# Altium schematic sheet COMM_2022-13-02.schdoc
size 425 x 175 mm
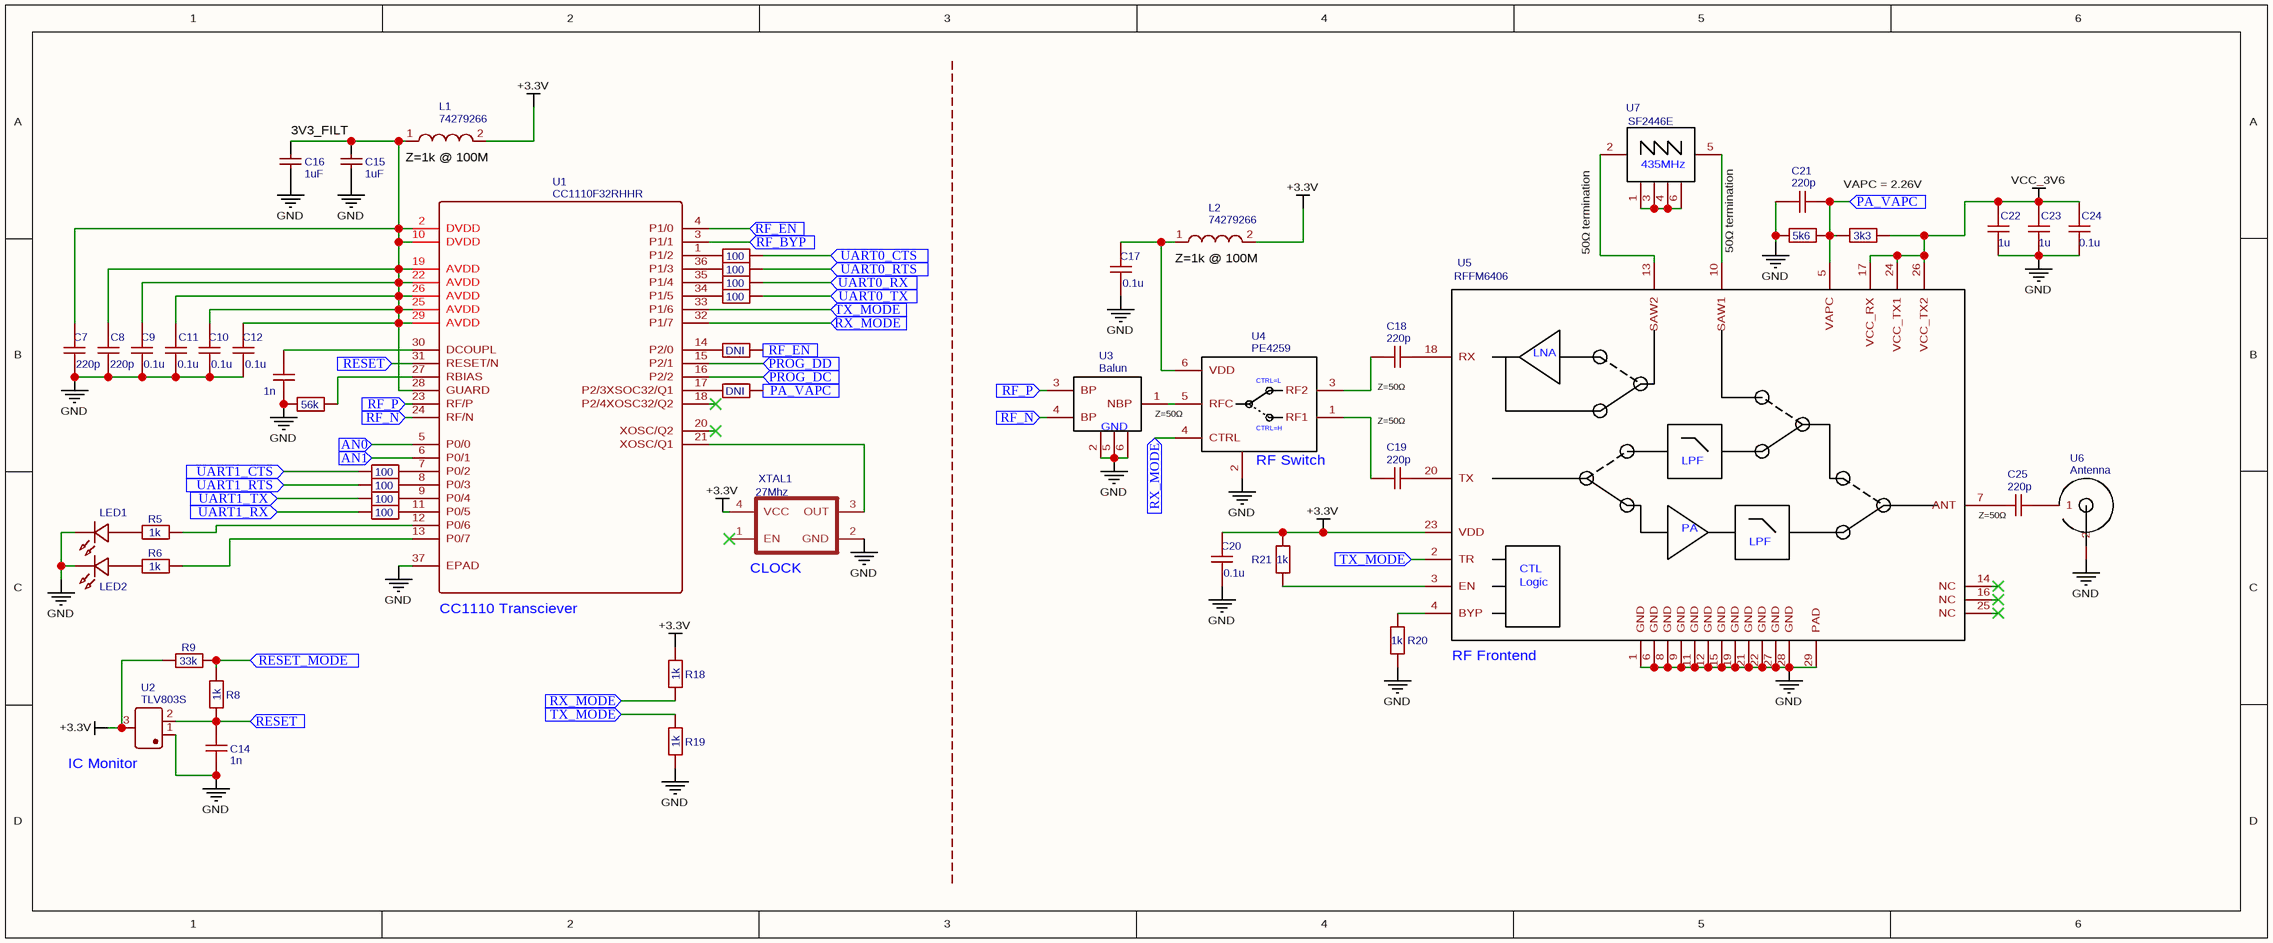
[diagram p0: COMM_2022-13-02.schdoc]

## Parts
C7  220p  [C0603]
C8  220p  [C0603]
C9  0.1u  [C0603]
C10  0.1u  [C0603]
C11  0.1u  [C0603]
C12  0.1u  [C0603]
C13  1n  [C0603]
C14  1n  [C0603]
C15  1uF  [CAP-TH_L7.6-W3.8-P5.08-D0.51]
C16  1uF  [CAP-TH_L7.6-W3.8-P5.08-D0.51]
C17  0.1u  [C0603]
C18  220p  [C0603]
C19  220p  [C0603]
C20  0.1u  [C0603]
C21  220p  [C0603]
C22  1u  [C0603]
C23  1u  [C0603]
C24  0.1u  [C0603]
C25  220p  [C0603]
L1  74279266  [SMD-0603]
L2  74279266  [SMD-0603]
LED1  LED-TH-3mm_R  [LED-TH_BD3.0_RED]  (value not drawn)
LED2  LED-TH-3mm_R  [LED-TH_BD3.0_RED]  (value not drawn)
R3  DNI  [R0603]
R4  DNI  [R0603]
R5  1k  [R0603]
R6  1k  [R0603]
R7  56k  [R0603]
R8  1k  [R0603]
R9  33k  [R0603]
R10  100  [R0603]
R11  100  [R0603]
R12  100  [R0603]
R13  100  [R0603]
R14  100  [R0603]
R15  100  [R0603]
R16  100  [R0603]
R17  100  [R0603]
R18  1k  [R0603]
R19  1k  [R0603]
R20  1k  [R0603]
R21  1k  [R0603]
R22  5k6  [R0603]
R23  3k3  [R0603]
U1  CC1110F32RHHR  [QFN-36_L6.0-W6.0-P0.50-TL-EP4.6]
U2  TLV803S  [TLV803]
U3  Balun  [BALUN]
U4  PE4259  [PE4259]
U5  RFFM6406  [RFFM6406]
U6  Antenna  [C908]
U7  SF2446E  [SF2446E]
XTAL1  27Mhz  [OSCILLATOR_7X5_SMD]

## Ports
AN0 (in), AN1 (in), PA_VAPC (in), PROG_DC (in), PROG_DD (in), RESET (in), RESET_MODE (in), RF_BYP (in), RF_EN (in), RF_N (in), RF_P (in), RX_MODE (in), TX_MODE (in), UART0_CTS (in), UART0_RTS (in), UART0_RX (in), UART0_TX (in), UART1_CTS (in), UART1_RTS (in), UART1_RX (in), UART1_TX (in)

## Nets
+3.3V: C20.2 L1.2 L2.2 R9.2 R18.2 R21.1 U2.3 U5.23(VDD) XTAL1.4(VCC)
GND: C7.1 C8.1 C9.1 C10.1 C11.1 C12.1 C13.1 C14.1 C15.1 C16.1 C17.1 C20.1 C21.2 C22.2 C23.2 C24.2 LED1.2 LED2.2 R7.2 R19.1 R20.1 R22.2 U1.37(EPAD) U2.1 U3.2(GND) U3.5(GND) U3.6(GND) U4.2(GND) U5.1(GND) U5.6(GND) U5.8(GND) U5.9(GND) U5.11(GND) U5.12(GND) U5.15(GND) U5.19(GND) U5.21(GND) U5.22(GND) U5.27(GND) U5.28(GND) U5.29(PAD) U6.2 XTAL1.2(GND)
VCC_3V6: C22.1 C23.1 C24.1 R23.1 U5.17(VCC_RX) U5.24(VCC_TX1) U5.26(VCC_TX2)
AN0: U1.5(P0/0) ; port AN0
AN1: U1.6(P0/1) ; port AN1
PA_VAPC: C21.1 R4.2 R22.1 R23.2 U5.5(VAPC) ; port PA_VAPC
PROG_DC: U1.16(P2/2) ; port PROG_DC
PROG_DD: U1.15(P2/1) ; port PROG_DD
RESET: C14.2 R8.1 U1.31(RESET/N) U2.2 ; port RESET
RESET_MODE: R8.2 R9.1 ; port RESET_MODE
RF_BYP: U1.3(P1/1) ; port RF_BYP
RF_EN: R3.2 U1.4(P1/0) ; port RF_EN
RF_N: U1.24(RF/N) U3.4(BP) ; port RF_N
RF_P: U1.23(RF/P) U3.3(BP) ; port RF_P
RX_MODE: R18.1 U1.32(P1/7) U4.4(CTRL) ; port RX_MODE
TX_MODE: R19.2 U1.33(P1/6) U5.2(TR) ; port TX_MODE
UART0_CTS: R17.2 ; port UART0_CTS
UART0_RTS: R16.2 ; port UART0_RTS
UART0_RX: R15.2 ; port UART0_RX
UART0_TX: R14.2 ; port UART0_TX
UART1_CTS: R10.1 ; port UART1_CTS
UART1_RTS: R11.1 ; port UART1_RTS
UART1_RX: R13.1 ; port UART1_RX
UART1_TX: R12.1 ; port UART1_TX
NetC7_2: C7.2 C8.2 C9.2 C10.2 C11.2 C12.2 C15.2 C16.2 L1.1 U1.2(DVDD) U1.10(DVDD) U1.19(AVDD) U1.22(AVDD) U1.25(AVDD) U1.26(AVDD) U1.28(GUARD) U1.29(AVDD)
NetC13_2: C13.2 U1.30(DCOUPL)
NetC17_2: C17.2 L2.1 U4.6(VDD)
NetC18_1: C18.1 U5.18(RX)
NetC18_2: C18.2 U4.3(RF2)
NetC19_1: C19.1 U5.20(TX)
NetC19_2: C19.2 U4.1(RF1)
NetC25_1: C25.1 U6.1
NetC25_2: C25.2 U5.7(ANT)
NetLED1_1: LED1.1 R5.1
NetLED2_1: LED2.1 R6.1
NetR3_1: R3.1 U1.14(P2/0)
NetR4_1: R4.1 U1.17(P2/3XSOC32/Q1)
NetR5_2: R5.2 U1.12(P0/6)
NetR6_2: R6.2 U1.13(P0/7)
NetR7_1: R7.1 U1.27(RBIAS)
NetR10_2: R10.2 U1.7(P0/2)
NetR11_2: R11.2 U1.8(P0/3)
NetR12_2: R12.2 U1.9(P0/4)
NetR13_2: R13.2 U1.11(P0/5)
NetR14_1: R14.1 U1.34(P1/5)
NetR15_1: R15.1 U1.35(P1/4)
NetR16_1: R16.1 U1.36(P1/3)
NetR17_1: R17.1 U1.1(P1/2)
NetR20_2: R20.2 U5.4(BYP)
NetR21_2: R21.2 U5.3(EN)
NetU1_21: U1.21(XOSC/Q1) XTAL1.3(OUT)
NetU3_1: U3.1(NBP) U4.5(RFC)
NetU5_10: U5.10(SAW1) U7.5
NetU5_13: U5.13(SAW2) U7.2
NetU7_1: U7.1 U7.3 U7.4 U7.6

Not connected (* = marked no-connect by the designer): U1 18(P2/4XOSC32/Q2)* 20(XOSC/Q2)*; U5 14(NC)* 16(NC)* 25(NC)*; XTAL1 1(EN)*

## Notes on the sheet
- 3V3_FILT
- (near L1) Z=1k @ 100M
- VAPC = 2.26V
- (near L2) Z=1k @ 100M
- 50Ω termination
- (near U3) Z=50Ω
- Z=50Ω
- (near C18) Z=50Ω
- (near U4) RF Switch
- (near U1) CC1110 Transciever
- (near XTAL1) CLOCK
- (near U5) RF Frontend
- (near U2) IC Monitor
- (in symbol PE4259) CTRL=L; CTRL=H
- (in symbol RFFM6406) LNA; LPF; PA; CTL; Logic
- (in symbol SF2446E) 435MHz

## Library data of the parts
C7 C8 C18 C19 C21 C25 = 220p: nameAlias: Value(F); Contributor: LCEDA_Lib; spicePre: C; spiceSymbolName: C_0603_US
C9-C12 C17 C20 C24 = 0.1u: nameAlias: Value(F); Contributor: LCEDA_Lib; spicePre: C; spiceSymbolName: C_0603_US
C13 C14 = 1n: nameAlias: Value(F); Contributor: LCEDA_Lib; spicePre: C; spiceSymbolName: C_0603_US
C15 C16 = 1uF: BOM_Manufacturer: AVX; BOM_Manufacturer Part: SR305C105KAR; nameAlias: Capacitance; Contributor: LCSC; BOM_Supplier: LCSC; BOM_Supplier Part: C444741; BOM_JLCPCB Part Class: Extended Part; spicePre: C; spiceSymbolName: SR305C105KAR
C22 C23 = 1u: nameAlias: Value(F); Contributor: LCEDA_Lib; spicePre: C; spiceSymbolName: C_0603_US
L1 L2 = 74279266: description: SMD EMI Suppression Ferrite Bead WE-CBF, Z; spicePre: L; spiceSymbolName: 74279266
LED1 LED2 = LED-TH-3mm_R: BOM_Manufacturer: EVERLIGHT(台湾亿光); BOM_Manufacturer Part: 204-10SDRD/S530-A3-L; Contributor: LCEDA_Lib; BOM_Supplier Part: C84774; BOM_Supplier: LCSC; spicePre: L; spiceSymbolName: LED-TH-3mm_R
R3 R4 = DNI: nameAlias: Value(Ω); Contributor: LCEDA_Lib; spicePre: R; spiceSymbolName: R_0603_EU
R5 R6 R8 R18-R21 = 1k: nameAlias: Value(Ω); Contributor: LCEDA_Lib; spicePre: R; spiceSymbolName: R_0603_EU
R7 = 56k: nameAlias: Value(Ω); Contributor: LCEDA_Lib; spicePre: R; spiceSymbolName: R_0603_EU
R9 = 33k: nameAlias: Value(Ω); Contributor: LCEDA_Lib; spicePre: R; spiceSymbolName: R_0603_EU
R10-R17 = 100: nameAlias: Value(Ω); Contributor: LCEDA_Lib; spicePre: R; spiceSymbolName: R_0603_EU
R22 = 5k6: nameAlias: Value(Ω); Contributor: LCEDA_Lib; spicePre: R; spiceSymbolName: R_0603_EU
R23 = 3k3: nameAlias: Value(Ω); Contributor: LCEDA_Lib; spicePre: R; spiceSymbolName: R_0603_EU
U1 = CC1110F32RHHR: BOM_Manufacturer: TI; Contributor: LCSC; BOM_Supplier: LCSC; BOM_Manufacturer Part: CC1110F32RHHR; BOM_Supplier Part: C117000; BOM_JLCPCB Part Class: Extended Part; spicePre: U; spiceSymbolName: CC1110F32RHHR
U2 = TLV803S: Package Display: No; spicePre: X; spiceSymbolName: TLV803S
U3 = Balun: BOM_Manufacturer Part: 0433BM15A0001E; Contributor: Arteen; spicePre: U; spiceSymbolName: Balun
U4 = PE4259: Contributor: IntenseFence1; BOM_Manufacturer Part: PE4259; spicePre: U; spiceSymbolName: RF Switch
U5 = RFFM6406: Contributor: IntenseFence1; BOM_Manufacturer Part: RFFM6406; spicePre: U; spiceSymbolName: RF Frontend
U6 = Antenna: Contributor: Arteen; spicePre: U; spiceSymbolName: Antenna
U7 = SF2446E: Contributor: Arteen; BOM_Manufacturer Part: SF2446E; spicePre: U; spiceSymbolName: Saw Filter 435MHz
XTAL1 = 27Mhz: Contributor: DangerousPrototype; spicePre: X; spiceSymbolName: OSC-OSCILLATOR